# EAGLE schematic Olympus v2 (EAGLE 7.4.0)
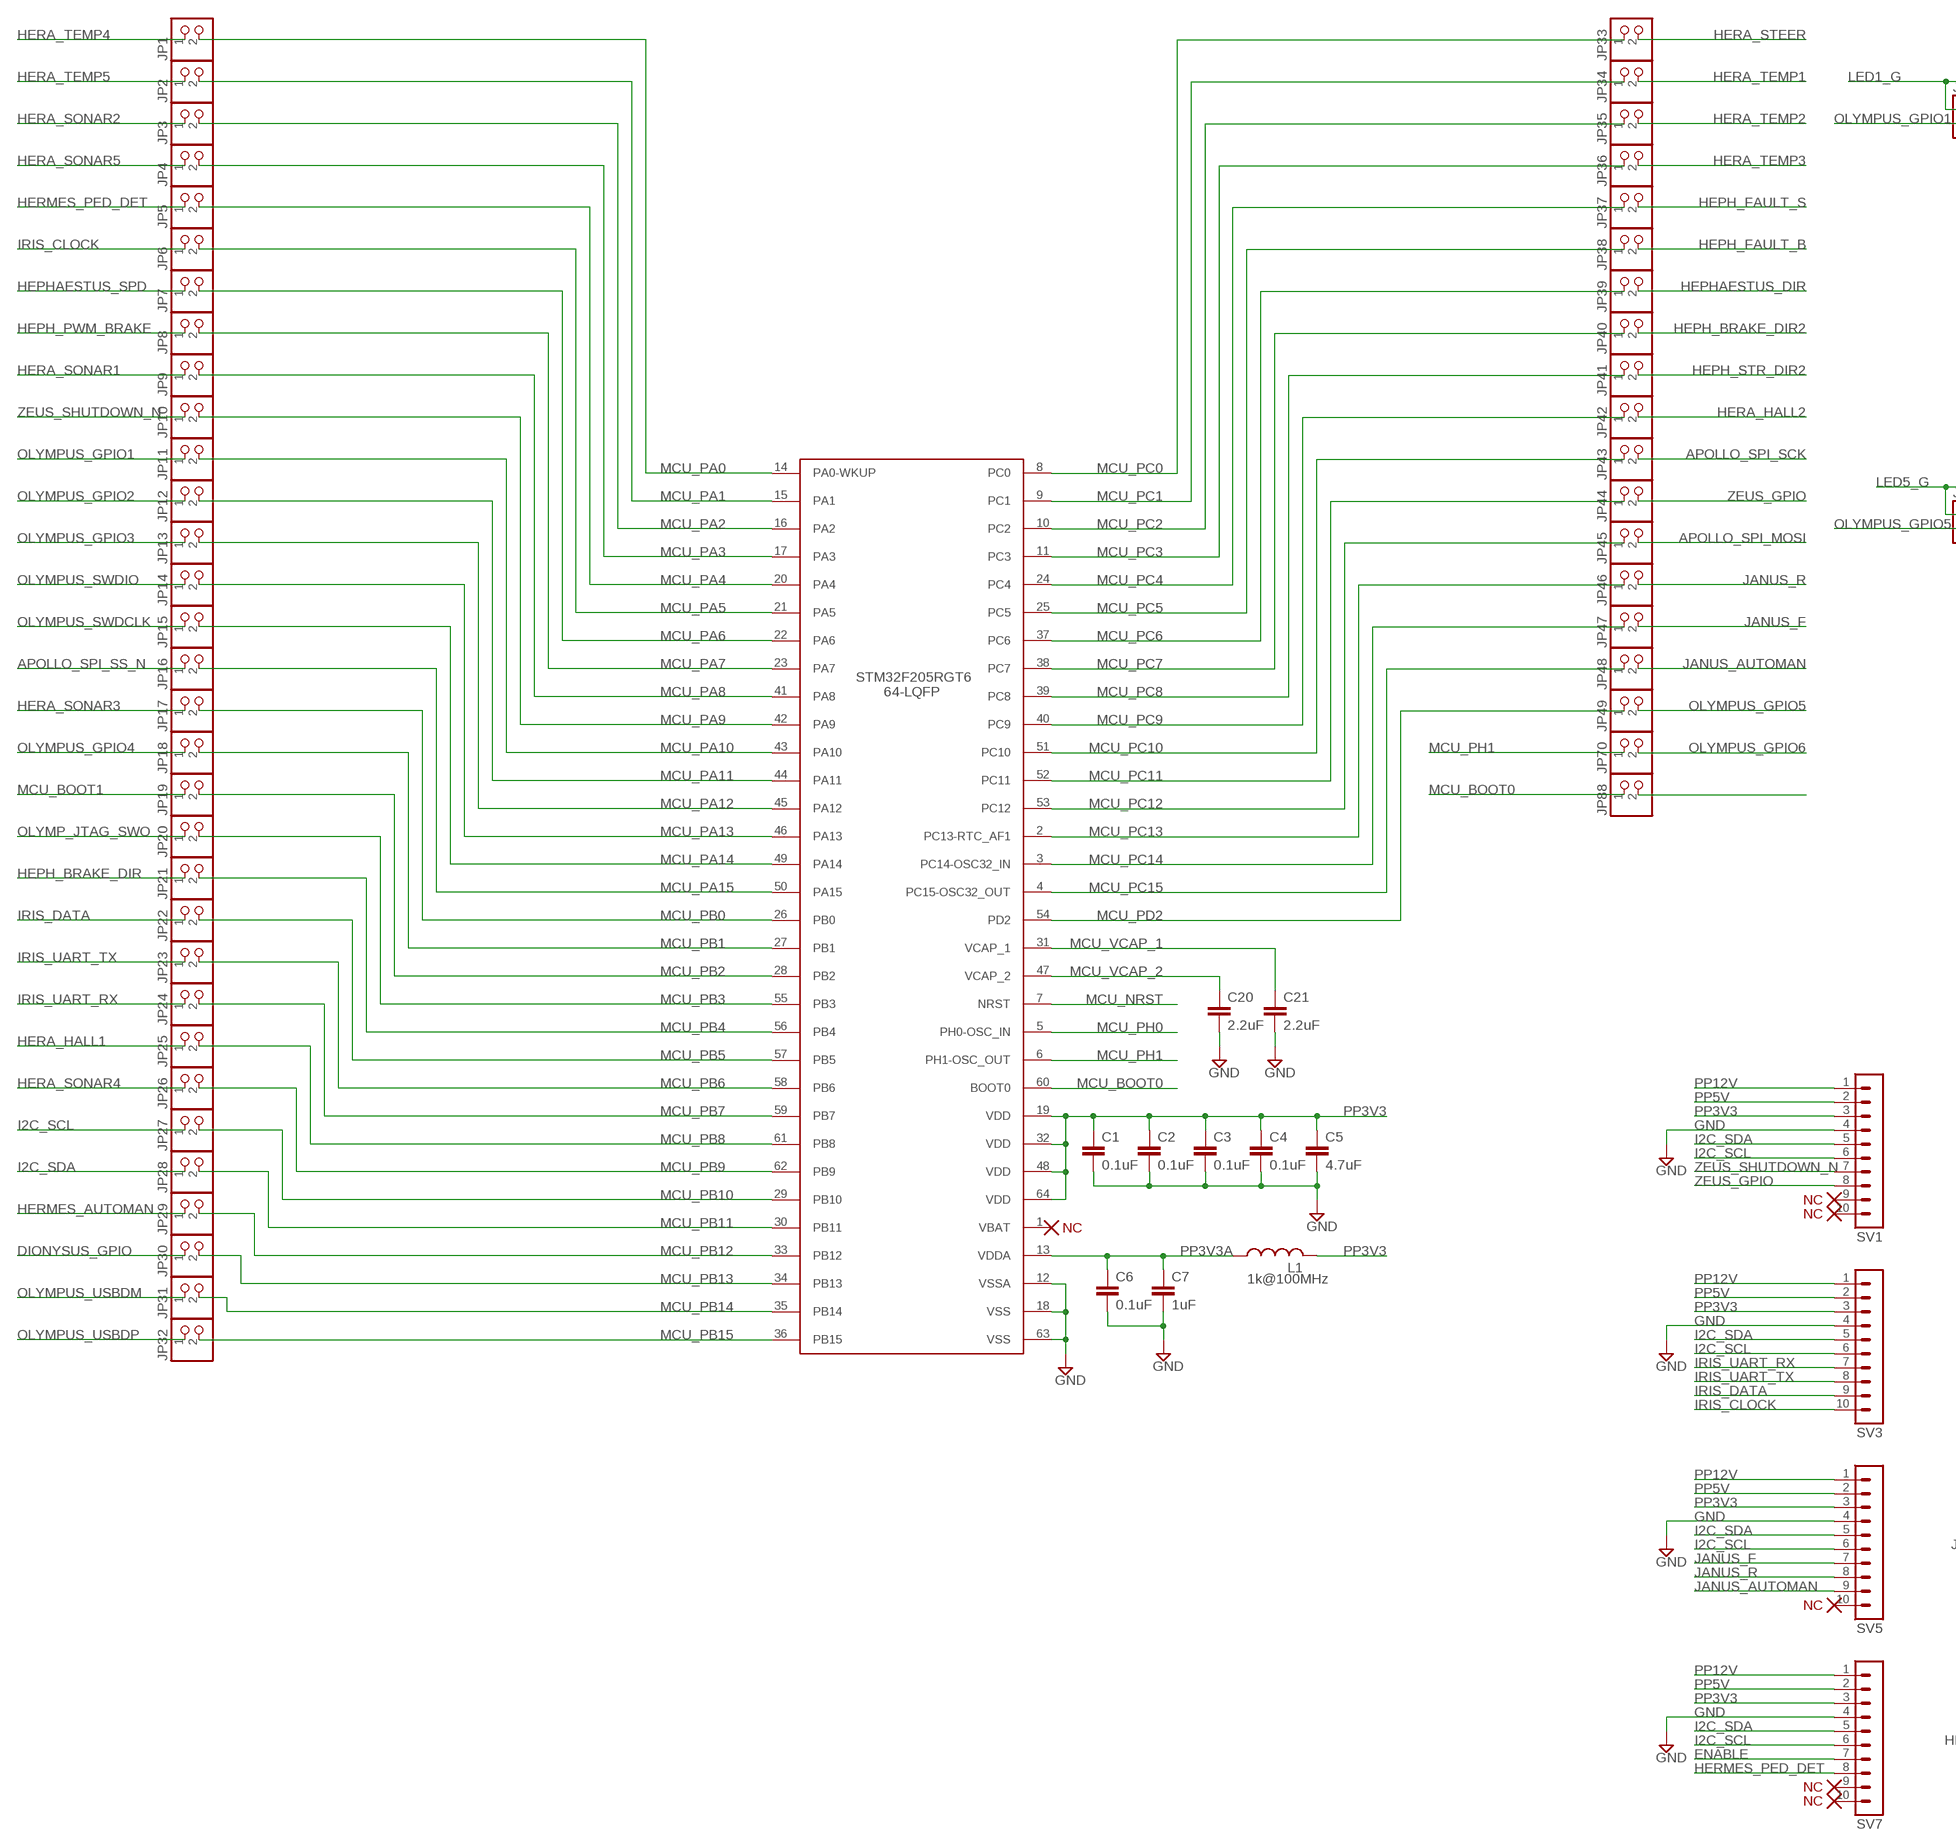
[diagram p0: schematic, sheet 1, part 1 of 2]
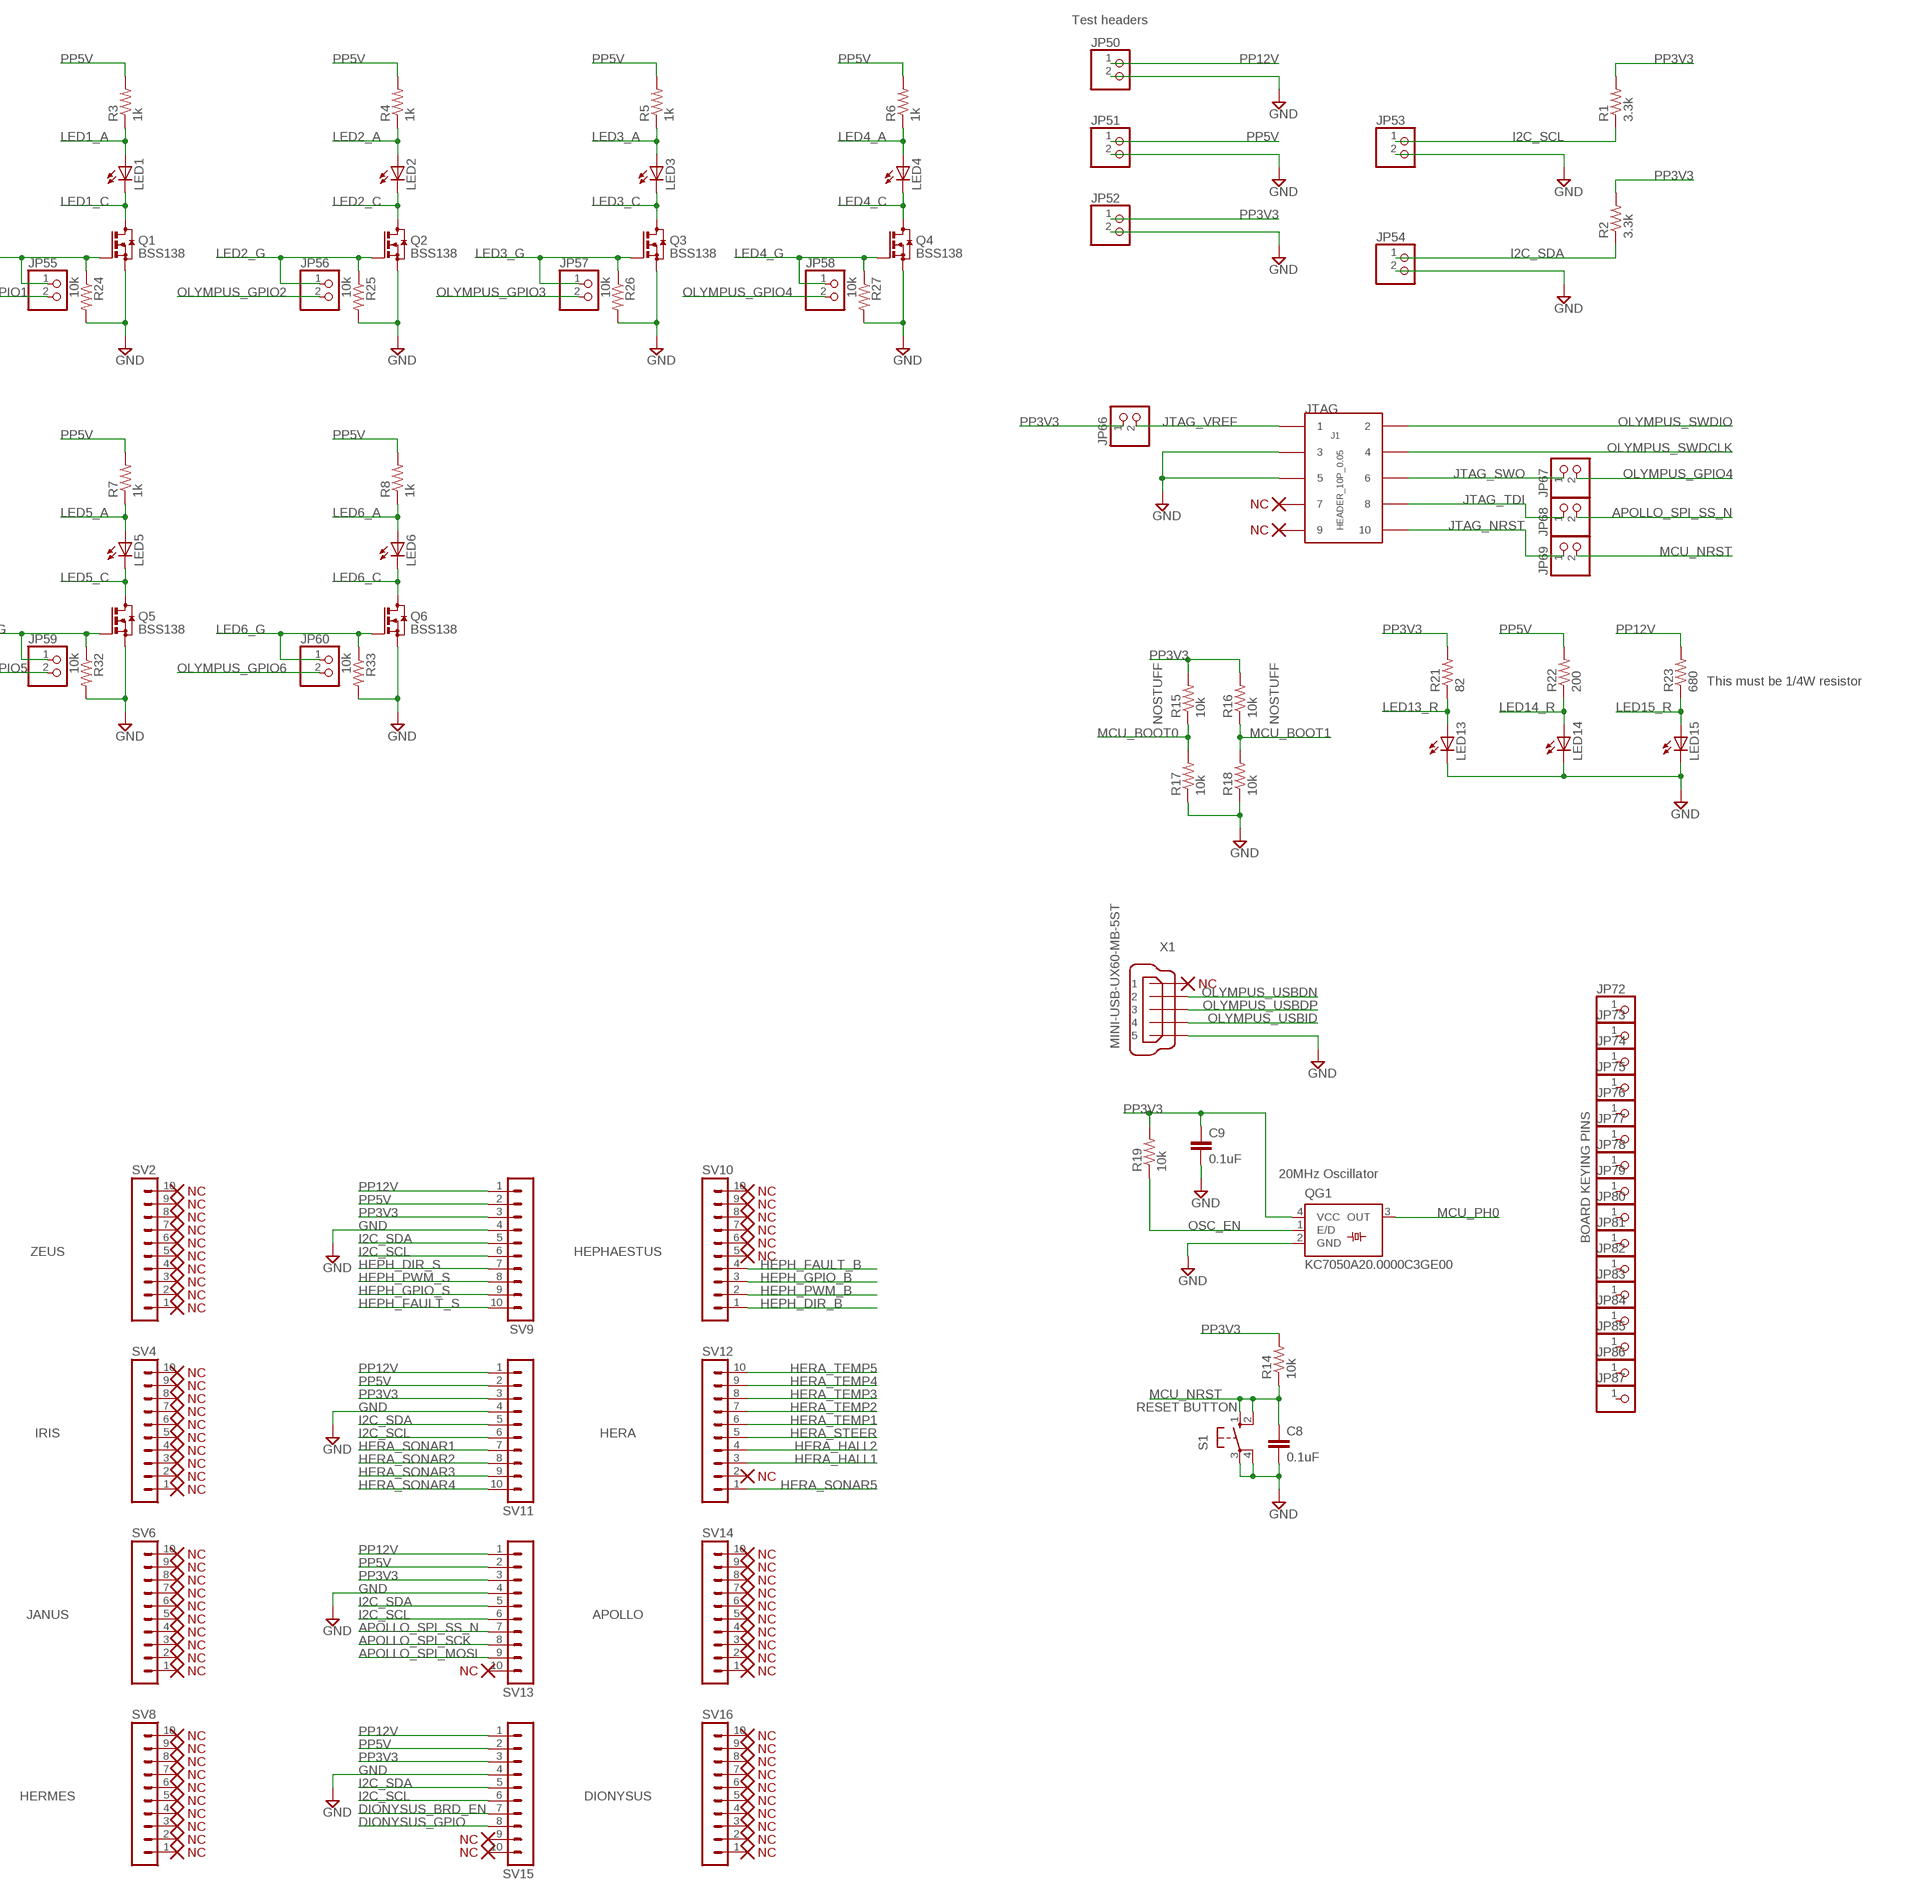
[diagram p1: schematic, sheet 1, part 2 of 2]

## Parts
C1  0.1uF  C-EUC0402  [C0402]
C2  0.1uF  C-EUC0402  [C0402]
C3  0.1uF  C-EUC0402  [C0402]
C4  0.1uF  C-EUC0402  [C0402]
C5  4.7uF  C-EUC0603  [C0603]
C6  0.1uF  C-EUC0402  [C0402]
C7  1uF  C-EUC0603  [C0603]
C8  0.1uF  C-EUC0402  [C0402]
C9  0.1uF  C-EUC0402  [C0402]
C20  2.2uF  C-EUC0402  [C0402]
C21  2.2uF  C-EUC0402  [C0402]
J1  HEADER_10P_0.05  [HEADER_10P_0.05]
JP1  PINHD-1X2  [1X02]
JP2  PINHD-1X2  [1X02]
JP3  PINHD-1X2  [1X02]
JP4  PINHD-1X2  [1X02]
JP5  PINHD-1X2  [1X02]
JP6  PINHD-1X2  [1X02]
JP7  PINHD-1X2  [1X02]
JP8  PINHD-1X2  [1X02]
JP9  PINHD-1X2  [1X02]
JP10  PINHD-1X2  [1X02]
JP11  PINHD-1X2  [1X02]
JP12  PINHD-1X2  [1X02]
JP13  PINHD-1X2  [1X02]
JP14  PINHD-1X2  [1X02]
JP15  PINHD-1X2  [1X02]
JP16  PINHD-1X2  [1X02]
JP17  PINHD-1X2  [1X02]
JP18  PINHD-1X2  [1X02]
JP19  PINHD-1X2  [1X02]
JP20  PINHD-1X2  [1X02]
JP21  PINHD-1X2  [1X02]
JP22  PINHD-1X2  [1X02]
JP23  PINHD-1X2  [1X02]
JP24  PINHD-1X2  [1X02]
JP25  PINHD-1X2  [1X02]
JP26  PINHD-1X2  [1X02]
JP27  PINHD-1X2  [1X02]
JP28  PINHD-1X2  [1X02]
JP29  PINHD-1X2  [1X02]
JP30  PINHD-1X2  [1X02]
JP31  PINHD-1X2  [1X02]
JP32  PINHD-1X2  [1X02]
JP33  PINHD-1X2  [1X02]
JP34  PINHD-1X2  [1X02]
JP35  PINHD-1X2  [1X02]
JP36  PINHD-1X2  [1X02]
JP37  PINHD-1X2  [1X02]
JP38  PINHD-1X2  [1X02]
JP39  PINHD-1X2  [1X02]
JP40  PINHD-1X2  [1X02]
JP41  PINHD-1X2  [1X02]
JP42  PINHD-1X2  [1X02]
JP43  PINHD-1X2  [1X02]
JP44  PINHD-1X2  [1X02]
JP45  PINHD-1X2  [1X02]
JP46  PINHD-1X2  [1X02]
JP47  PINHD-1X2  [1X02]
JP48  PINHD-1X2  [1X02]
JP49  PINHD-1X2  [1X02]
JP50  PINHD-1X2  [1X02]
JP51  PINHD-1X2  [1X02]
JP52  PINHD-1X2  [1X02]
JP53  PINHD-1X2  [1X02]
JP54  PINHD-1X2  [1X02]
JP55  PINHD-1X2  [1X02]
JP56  PINHD-1X2  [1X02]
JP57  PINHD-1X2  [1X02]
JP58  PINHD-1X2  [1X02]
JP59  PINHD-1X2  [1X02]
JP60  PINHD-1X2  [1X02]
JP66  PINHD-1X2  [1X02]
JP67  PINHD-1X2  [1X02]
JP68  PINHD-1X2  [1X02]
JP69  PINHD-1X2  [1X02]
JP70  PINHD-1X2  [1X02]
JP72  PINHD-1X1  [1X01]
JP73  PINHD-1X1  [1X01]
JP74  PINHD-1X1  [1X01]
JP75  PINHD-1X1  [1X01]
JP76  PINHD-1X1  [1X01]
JP77  PINHD-1X1  [1X01]
JP78  PINHD-1X1  [1X01]
JP79  PINHD-1X1  [1X01]
JP80  PINHD-1X1  [1X01]
JP81  PINHD-1X1  [1X01]
JP82  PINHD-1X1  [1X01]
JP83  PINHD-1X1  [1X01]
JP84  PINHD-1X1  [1X01]
JP85  PINHD-1X1  [1X01]
JP86  PINHD-1X1  [1X01]
JP87  PINHD-1X1  [1X01]
JP88  PINHD-1X2  [1X02]
L1  L-USL0201  [L0201]
LED1  LEDCHIP-LED0603  [CHIP-LED0603]
LED2  LEDCHIP-LED0603  [CHIP-LED0603]
LED3  LEDCHIP-LED0603  [CHIP-LED0603]
LED4  LEDCHIP-LED0603  [CHIP-LED0603]
LED5  LEDCHIP-LED0603  [CHIP-LED0603]
LED6  LEDCHIP-LED0603  [CHIP-LED0603]
LED13  LEDCHIP-LED0603  [CHIP-LED0603]
LED14  LEDCHIP-LED0603  [CHIP-LED0603]
LED15  LEDCHIP-LED0603  [CHIP-LED0603]
Q1  BSS138  BSS123  [SOT23]
Q2  BSS138  BSS123  [SOT23]
Q3  BSS138  BSS123  [SOT23]
Q4  BSS138  BSS123  [SOT23]
Q5  BSS138  BSS123  [SOT23]
Q6  BSS138  BSS123  [SOT23]
QG1  KC7050A20.0000C3GE00  SM77H  [SM77H]
R1  3.3k  R-US_R0603  [R0603]
R2  3.3k  R-US_R0603  [R0603]
R3  1k  R-US_R0603  [R0603]
R4  1k  R-US_R0603  [R0603]
R5  1k  R-US_R0603  [R0603]
R6  1k  R-US_R0603  [R0603]
R7  1k  R-US_R0603  [R0603]
R8  1k  R-US_R0603  [R0603]
R14  10k  R-US_R0603  [R0603]
R15  10k  R-US_R0603  [R0603]
R16  10k  R-US_R0603  [R0603]
R17  10k  R-US_R0603  [R0603]
R18  10k  R-US_R0603  [R0603]
R19  10k  R-US_R0603  [R0603]
R21  82  R-US_R0603  [R0603]
R22  200  R-US_R0603  [R0603]
R23  680  R-US_R0603  [R0603]
R24  10k  R-US_R0603  [R0603]
R25  10k  R-US_R0603  [R0603]
R26  10k  R-US_R0603  [R0603]
R27  10k  R-US_R0603  [R0603]
R32  10k  R-US_R0603  [R0603]
R33  10k  R-US_R0603  [R0603]
S1  10-XX  [B3F-10XX]
SV1  MA10-1  [MA10-1]
SV2  MA10-1  [MA10-1]
SV3  MA10-1  [MA10-1]
SV4  MA10-1  [MA10-1]
SV5  MA10-1  [MA10-1]
SV6  MA10-1  [MA10-1]
SV7  MA10-1  [MA10-1]
SV8  MA10-1  [MA10-1]
SV9  MA10-1  [MA10-1]
SV10  MA10-1  [MA10-1]
SV11  MA10-1  [MA10-1]
SV12  MA10-1  [MA10-1]
SV13  MA10-1  [MA10-1]
SV14  MA10-1  [MA10-1]
SV15  MA10-1  [MA10-1]
SV16  MA10-1  [MA10-1]
U1  STM32F205RGT6  [LQFP-ST-64-2]
X1  MINI-USB-UX60-MB-5ST  [UX60-MB-5ST]

## Nets
APOLLO_SPI_MOSI: JP45.2 SV13.9
APOLLO_SPI_SCK: JP43.2 SV13.8
APOLLO_SPI_SS_N: JP16.1 JP68.2 SV13.7
DIONYSUS_BRD_EN: SV15.7
DIONYSUS_GPIO: JP30.1 SV15.8
ENABLE: SV7.7
GND: C1.2 C2.2 C3.2 C4.2 C5.2 C6.2 C7.2 C8.2 C9.2 C20.2 C21.2 J1.3 J1.5 JP50.2 JP51.2 JP52.2 JP53.2 JP54.2 LED13.C LED14.C LED15.C Q1.2(S) Q2.2(S) Q3.2(S) Q4.2(S) Q5.2(S) Q6.2(S) QG1.2(GND) R17.1 R18.1 R24.2 R25.2 R26.2 R27.2 R32.2 R33.2 S1.3(P) S1.4(P1) SV1.4 SV3.4 SV5.4 SV7.4 SV9.4 SV11.4 SV13.4 SV15.4 U1.12(VSSA) U1.18(VSS) U1.63(VSS) X1.5
HEPH_BRAKE_DIR: JP21.1
HEPH_BRAKE_DIR2: JP40.2
HEPH_DIR_B: SV10.1
HEPH_DIR_S: SV9.7
HEPH_FAULT_B: JP38.2 SV10.4
HEPH_FAULT_S: JP37.2 SV9.10
HEPH_GPIO_B: SV10.3
HEPH_GPIO_S: SV9.9
HEPH_PWM_B: SV10.2
HEPH_PWM_BRAKE: JP8.1
HEPH_PWM_S: SV9.8
HEPH_STR_DIR2: JP41.2
HEPHAESTUS_DIR: JP39.2
HEPHAESTUS_SPD: JP7.1
HERA_HALL1: JP25.1 SV12.3
HERA_HALL2: JP42.2 SV12.4
HERA_SONAR1: JP9.1 SV11.7
HERA_SONAR2: JP3.1 SV11.8
HERA_SONAR3: JP17.1 SV11.9
HERA_SONAR4: JP26.1 SV11.10
HERA_SONAR5: JP4.1 SV12.1
HERA_STEER: JP33.2 SV12.5
HERA_TEMP1: JP34.2 SV12.6
HERA_TEMP2: JP35.2 SV12.7
HERA_TEMP3: JP36.2 SV12.8
HERA_TEMP4: JP1.1 SV12.9
HERA_TEMP5: JP2.1 SV12.10
HERMES_AUTOMAN: JP29.1
HERMES_PED_DET: JP5.1 SV7.8
I2C_SCL: JP27.1 JP53.1 R1.1 SV1.6 SV3.6 SV5.6 SV7.6 SV9.6 SV11.6 SV13.6 SV15.6
I2C_SDA: JP28.1 JP54.1 R2.1 SV1.5 SV3.5 SV5.5 SV7.5 SV9.5 SV11.5 SV13.5 SV15.5
IRIS_CLOCK: JP6.1 SV3.10
IRIS_DATA: JP22.1 SV3.9
IRIS_UART_RX: JP24.1 SV3.7
IRIS_UART_TX: JP23.1 SV3.8
JANUS_AUTOMAN: JP48.2 SV5.9
JANUS_F: JP47.2 SV5.7
JANUS_R: JP46.2 SV5.8
JTAG_NRST: J1.10 JP69.1
JTAG_SWO: J1.6 JP67.1
JTAG_TDI: J1.8 JP68.1
JTAG_VREF: J1.1 JP66.2
LED1_A: LED1.A R3.1
LED1_C: LED1.C Q1.3(D)
LED1_G: JP55.1 Q1.1(G) R24.1
LED2_A: LED2.A R4.1
LED2_C: LED2.C Q2.3(D)
LED2_G: JP56.1 Q2.1(G) R25.1
LED3_A: LED3.A R5.1
LED3_C: LED3.C Q3.3(D)
LED3_G: JP57.1 Q3.1(G) R26.1
LED4_A: LED4.A R6.1
LED4_C: LED4.C Q4.3(D)
LED4_G: JP58.1 Q4.1(G) R27.1
LED5_A: LED5.A R7.1
LED5_C: LED5.C Q5.3(D)
LED5_G: JP59.1 Q5.1(G) R32.1
LED6_A: LED6.A R8.1
LED6_C: LED6.C Q6.3(D)
LED6_G: JP60.1 Q6.1(G) R33.1
LED13_R: LED13.A R21.1
LED14_R: LED14.A R22.1
LED15_R: LED15.A R23.1
MCU_BOOT0: JP88.1 R15.1 R17.2 U1.60(BOOT0)
MCU_BOOT1: JP19.1 R16.1 R18.2
MCU_NRST: C8.1 JP69.2 R14.1 S1.1(S) S1.2(S1) U1.7(NRST)
MCU_PA0: JP1.2 U1.14(PA0-WKUP)
MCU_PA1: JP2.2 U1.15(PA1)
MCU_PA2: JP3.2 U1.16(PA2)
MCU_PA3: JP4.2 U1.17(PA3)
MCU_PA4: JP5.2 U1.20(PA4)
MCU_PA5: JP6.2 U1.21(PA5)
MCU_PA6: JP7.2 U1.22(PA6)
MCU_PA7: JP8.2 U1.23(PA7)
MCU_PA8: JP9.2 U1.41(PA8)
MCU_PA9: JP10.2 U1.42(PA9)
MCU_PA10: JP11.2 U1.43(PA10)
MCU_PA11: JP12.2 U1.44(PA11)
MCU_PA12: JP13.2 U1.45(PA12)
MCU_PA13: JP14.2 U1.46(PA13)
MCU_PA14: JP15.2 U1.49(PA14)
MCU_PA15: JP16.2 U1.50(PA15)
MCU_PB0: JP17.2 U1.26(PB0)
MCU_PB1: JP18.2 U1.27(PB1)
MCU_PB2: JP19.2 U1.28(PB2)
MCU_PB3: JP20.2 U1.55(PB3)
MCU_PB4: JP21.2 U1.56(PB4)
MCU_PB5: JP22.2 U1.57(PB5)
MCU_PB6: JP23.2 U1.58(PB6)
MCU_PB7: JP24.2 U1.59(PB7)
MCU_PB8: JP25.2 U1.61(PB8)
MCU_PB9: JP26.2 U1.62(PB9)
MCU_PB10: JP27.2 U1.29(PB10)
MCU_PB11: JP28.2 U1.30(PB11)
MCU_PB12: JP29.2 U1.33(PB12)
MCU_PB13: JP30.2 U1.34(PB13)
MCU_PB14: JP31.2 U1.35(PB14)
MCU_PB15: JP32.2 U1.36(PB15)
MCU_PC0: JP33.1 U1.8(PC0)
MCU_PC1: JP34.1 U1.9(PC1)
MCU_PC2: JP35.1 U1.10(PC2)
MCU_PC3: JP36.1 U1.11(PC3)
MCU_PC4: JP37.1 U1.24(PC4)
MCU_PC5: JP38.1 U1.25(PC5)
MCU_PC6: JP39.1 U1.37(PC6)
MCU_PC7: JP40.1 U1.38(PC7)
MCU_PC8: JP41.1 U1.39(PC8)
MCU_PC9: JP42.1 U1.40(PC9)
MCU_PC10: JP43.1 U1.51(PC10)
MCU_PC11: JP44.1 U1.52(PC11)
MCU_PC12: JP45.1 U1.53(PC12)
MCU_PC13: JP46.1 U1.2(PC13-RTC_AF1)
MCU_PC14: JP47.1 U1.3(PC14-OSC32_IN)
MCU_PC15: JP48.1 U1.4(PC15-OSC32_OUT)
MCU_PD2: JP49.1 U1.54(PD2)
MCU_PH0: QG1.3(OUT) U1.5(PH0-OSC_IN)
MCU_PH1: JP70.1 U1.6(PH1-OSC_OUT)
MCU_VCAP_1: C21.1 U1.31(VCAP_1)
MCU_VCAP_2: C20.1 U1.47(VCAP_2)
N$2: JP88.2
OLYMP_JTAG_SWO: JP20.1
OLYMPUS_GPIO1: JP11.1 JP55.2
OLYMPUS_GPIO2: JP12.1 JP56.2
OLYMPUS_GPIO3: JP13.1 JP57.2
OLYMPUS_GPIO4: JP18.1 JP58.2 JP67.2
OLYMPUS_GPIO5: JP49.2 JP59.2
OLYMPUS_GPIO6: JP60.2 JP70.2
OLYMPUS_SWDCLK: J1.4 JP15.1
OLYMPUS_SWDIO: J1.2 JP14.1
OLYMPUS_USBDM: JP31.1
OLYMPUS_USBDN: X1.2
OLYMPUS_USBDP: JP32.1 X1.3
OLYMPUS_USBID: X1.4
OSC_EN: QG1.1(E/D) R19.1
PP3V3: C1.1 C2.1 C3.1 C4.1 C5.1 C9.1 JP52.1 JP66.1 L1.2 QG1.4(VCC) R1.2 R2.2 R14.2 R15.2 R16.2 R19.2 R21.2 SV1.3 SV3.3 SV5.3 SV7.3 SV9.3 SV11.3 SV13.3 SV15.3 U1.19(VDD) U1.32(VDD) U1.48(VDD) U1.64(VDD)
PP3V3A: C6.1 C7.1 L1.1 U1.13(VDDA)
PP5V: JP51.1 R3.2 R4.2 R5.2 R6.2 R7.2 R8.2 R22.2 SV1.2 SV3.2 SV5.2 SV7.2 SV9.2 SV11.2 SV13.2 SV15.2
PP12V: JP50.1 R23.2 SV1.1 SV3.1 SV5.1 SV7.1 SV9.1 SV11.1 SV13.1 SV15.1
ZEUS_GPIO: JP44.2 SV1.8
ZEUS_SHUTDOWN_N: JP10.1 SV1.7
Unconnected: J1.7 J1.9 JP72.1 JP73.1 JP74.1 JP75.1 JP76.1 JP77.1 JP78.1 JP79.1 JP80.1 JP81.1 JP82.1 JP83.1 JP84.1 JP85.1 JP86.1 JP87.1 SV1.9 SV1.10 SV2.1 SV2.2 SV2.3 SV2.4 SV2.5 SV2.6 SV2.7 SV2.8 SV2.9 SV2.10 SV4.1 SV4.2 SV4.3 SV4.4 SV4.5 SV4.6 SV4.7 SV4.8 SV4.9 SV4.10 SV5.10 SV6.1 SV6.2 SV6.3 SV6.4 SV6.5 SV6.6 SV6.7 SV6.8 SV6.9 SV6.10 SV7.9 SV7.10 SV8.1 SV8.2 SV8.3 SV8.4 SV8.5 SV8.6 SV8.7 SV8.8 SV8.9 SV8.10 SV10.5 SV10.6 SV10.7 SV10.8 SV10.9 SV10.10 SV12.2 SV13.10 SV14.1 SV14.2 SV14.3 SV14.4 SV14.5 SV14.6 SV14.7 SV14.8 SV14.9 SV14.10 SV15.9 SV15.10 SV16.1 SV16.2 SV16.3 SV16.4 SV16.5 SV16.6 SV16.7 SV16.8 SV16.9 SV16.10 U1.1(VBAT) X1.1

## Notes on the sheet
- Test headers
- JTAG
- This must be 1/4W resistor
- 20MHz Oscillator
- BOARD KEYING PINS
- ZEUS | HEPHAESTUS
- 1k@100MHz
- RESET BUTTON
- IRIS | HERA
- JANUS | APOLLO
- HERMES | DIONYSUS

## Library data of the parts
C1-C9 C20 C21 = rcl:C-EU: CAPACITOR, European symbol
J1 = Olympus:HEADER_10P_0.05: 10 pin header. 0.05in pitch. Used in JTAG; DIGI: 1175-1627-ND
JP1-JP60 JP66-JP70 JP88 = pinhead:PINHD-1X2: PIN HEADER
JP72-JP87 = pinhead:PINHD-1X1: PIN HEADER; DIGI: SAM1067-50-ND
L1 = rcl:L-US: INDUCTOR, American symbol; DIGI: 445-15755-1-ND
LED1-LED6 = led:LED: LED OSRAM: - CHIPLED LG R971, LG N971, LY N971, LG Q971, LY Q971, LO R971, LY R971 LH N974, LH R974 LS Q976, LO Q976, LY Q976 LO Q996 - Hyper CHIPLED LW Q18S LB Q993, LB Q99A, LB R99A - SideLED LS A670, LO A670, LY A670, LG A670, LP A670 LB A673, LV A673, LT A673, LW A673 LH A674 LY A675 LS A676, LA A676, LO A676, LY A676, LW A676 LS A679, LY A679, LG A679 - Hyper Micro SIDELED® LS Y876, LA Y876, LO Y876, LY Y876 LT Y87S - SmartLED LW L88C, LW L88S LB L89C, LB L89S, LG L890 LS L89K, LO L89K, LY L89K LS L896, LA L896, LO L896, LY L896 - TOPLED LS T670, LO T670, LY T670, LG T670, LP T670 LSG T670, LSP T670, LSY T670, LOP T670, LYG T670 LG T671, LOG T671, LSG T671 LB T673, LV T673, LT T673, LW T673 LH T674 LS T676, LA T676, LO T676, LY T676, LB T676, LH T676, LSB T676, LW T676 LB T67C, LV T67C, LT T67C, LS T67K, LO T67K, LY T67K, LW E67C LS E67B, LA E67B, LO E67B, LY E67B, LB E67C, LV E67C, LT E67C LW T67C LS T679, LY T679, LG T679 LS T770, LO T770, LY T770, LG T770, LP T770 LB T773, LV T773, LT T773, LW T773 LH T774 LS E675, LA E675, LY E675, LS T675 LS T776, LA T776, LO T776, LY T776, LB T776 LHGB T686 LT T68C, LB T68C - Hyper Mini TOPLED® LB M676 - Mini TOPLED Santana® LG M470 LS M47K, LO M47K, LY M47K Source: http://www.osram.convergy.de LUXEON: - LUMILED® LXK2-PW12-R00, LXK2-PW12-S00, LXK2-PW14-U00, LXK2-PW14-V00 LXK2-PM12-R00, LXK2-PM12-S00, LXK2-PM14-U00 LXK2-PE12-Q00, LXK2-PE12-R00, LXK2-PE12-S00, LXK2-PE14-T00, LXK2-PE14-U00 LXK2-PB12-K00, LXK2-PB12-L00, LXK2-PB12-M00, LXK2-PB14-N00, LXK2-PB14-P00, LXK2-PB14-Q00 LXK2-PR12-L00, LXK2-PR12-M00, LXK2-PR14-Q00, LXK2-PR14-R00 LXK2-PD12-Q00, LXK2-PD12-R00, LXK2-PD12-S00 LXK2-PH12-R00, LXK2-PH12-S00 LXK2-PL12-P00, LXK2-PL12-Q00, LXK2-PL12-R00 Source: www.luxeon.com KINGBRIGHT: KA-3528ASYC Source: www.kingbright.com; DIGI: 732-4966-1-ND
LED13-LED15 = led:LED: LED OSRAM: - CHIPLED LG R971, LG N971, LY N971, LG Q971, LY Q971, LO R971, LY R971 LH N974, LH R974 LS Q976, LO Q976, LY Q976 LO Q996 - Hyper CHIPLED LW Q18S LB Q993, LB Q99A, LB R99A - SideLED LS A670, LO A670, LY A670, LG A670, LP A670 LB A673, LV A673, LT A673, LW A673 LH A674 LY A675 LS A676, LA A676, LO A676, LY A676, LW A676 LS A679, LY A679, LG A679 - Hyper Micro SIDELED® LS Y876, LA Y876, LO Y876, LY Y876 LT Y87S - SmartLED LW L88C, LW L88S LB L89C, LB L89S, LG L890 LS L89K, LO L89K, LY L89K LS L896, LA L896, LO L896, LY L896 - TOPLED LS T670, LO T670, LY T670, LG T670, LP T670 LSG T670, LSP T670, LSY T670, LOP T670, LYG T670 LG T671, LOG T671, LSG T671 LB T673, LV T673, LT T673, LW T673 LH T674 LS T676, LA T676, LO T676, LY T676, LB T676, LH T676, LSB T676, LW T676 LB T67C, LV T67C, LT T67C, LS T67K, LO T67K, LY T67K, LW E67C LS E67B, LA E67B, LO E67B, LY E67B, LB E67C, LV E67C, LT E67C LW T67C LS T679, LY T679, LG T679 LS T770, LO T770, LY T770, LG T770, LP T770 LB T773, LV T773, LT T773, LW T773 LH T774 LS E675, LA E675, LY E675, LS T675 LS T776, LA T776, LO T776, LY T776, LB T776 LHGB T686 LT T68C, LB T68C - Hyper Mini TOPLED® LB M676 - Mini TOPLED Santana® LG M470 LS M47K, LO M47K, LY M47K Source: http://www.osram.convergy.de LUXEON: - LUMILED® LXK2-PW12-R00, LXK2-PW12-S00, LXK2-PW14-U00, LXK2-PW14-V00 LXK2-PM12-R00, LXK2-PM12-S00, LXK2-PM14-U00 LXK2-PE12-Q00, LXK2-PE12-R00, LXK2-PE12-S00, LXK2-PE14-T00, LXK2-PE14-U00 LXK2-PB12-K00, LXK2-PB12-L00, LXK2-PB12-M00, LXK2-PB14-N00, LXK2-PB14-P00, LXK2-PB14-Q00 LXK2-PR12-L00, LXK2-PR12-M00, LXK2-PR14-Q00, LXK2-PR14-R00 LXK2-PD12-Q00, LXK2-PD12-R00, LXK2-PD12-S00 LXK2-PH12-R00, LXK2-PH12-S00 LXK2-PL12-P00, LXK2-PL12-Q00, LXK2-PL12-R00 Source: www.luxeon.com KINGBRIGHT: KA-3528ASYC Source: www.kingbright.com; DIGI: 160-1435-1-ND
Q1-Q6 = transistor-small-signal:BSS123: N-CHANNEL MOS FET; DIGI: BSS138CT-ND
QG1 = crystal:SM77H: 3.3V CMOS Clock Oscillator Source: www.pletronics.com .. sm77h%203.3v.pdf; DIGI: 1253-1317-1-ND; OC_FARNELL: unknown; OC_NEWARK: unknown
R1 R2 R14 R17-R19 = rcl:R-US_: RESISTOR, American symbol
R3-R8 R21-R27 R32 R33 = resistor:R-US_: RESISTOR, American symbol
R15 R16 = rcl:R-US_: RESISTOR, American symbol; BOMOPTION: NOSTUFF
S1 = switch-omron:10-XX: OMRON SWITCH; DIGI: 679-2428-ND; MPN: B3F-1000; OC_FARNELL: 176432; OC_NEWARK: 36M3542
SV1-SV16 = con-lstb:MA10-1: PIN HEADER; OC_FARNELL: unknown; OC_NEWARK: unknown
U1 = Olympus:STM32F205RGT6: STM32F205RGT6; DIGI: 497-11157-ND
X1 = con-hirose:MINI-USB-: MINI USB Connector Source: http://www.hirose.co.jp/cataloge_hp/e24000019.pdf; DIGI: H2959CT-ND; OC_FARNELL: unknown; OC_NEWARK: unknown